# Altium project USB_SPI_Flash.PrjPcb
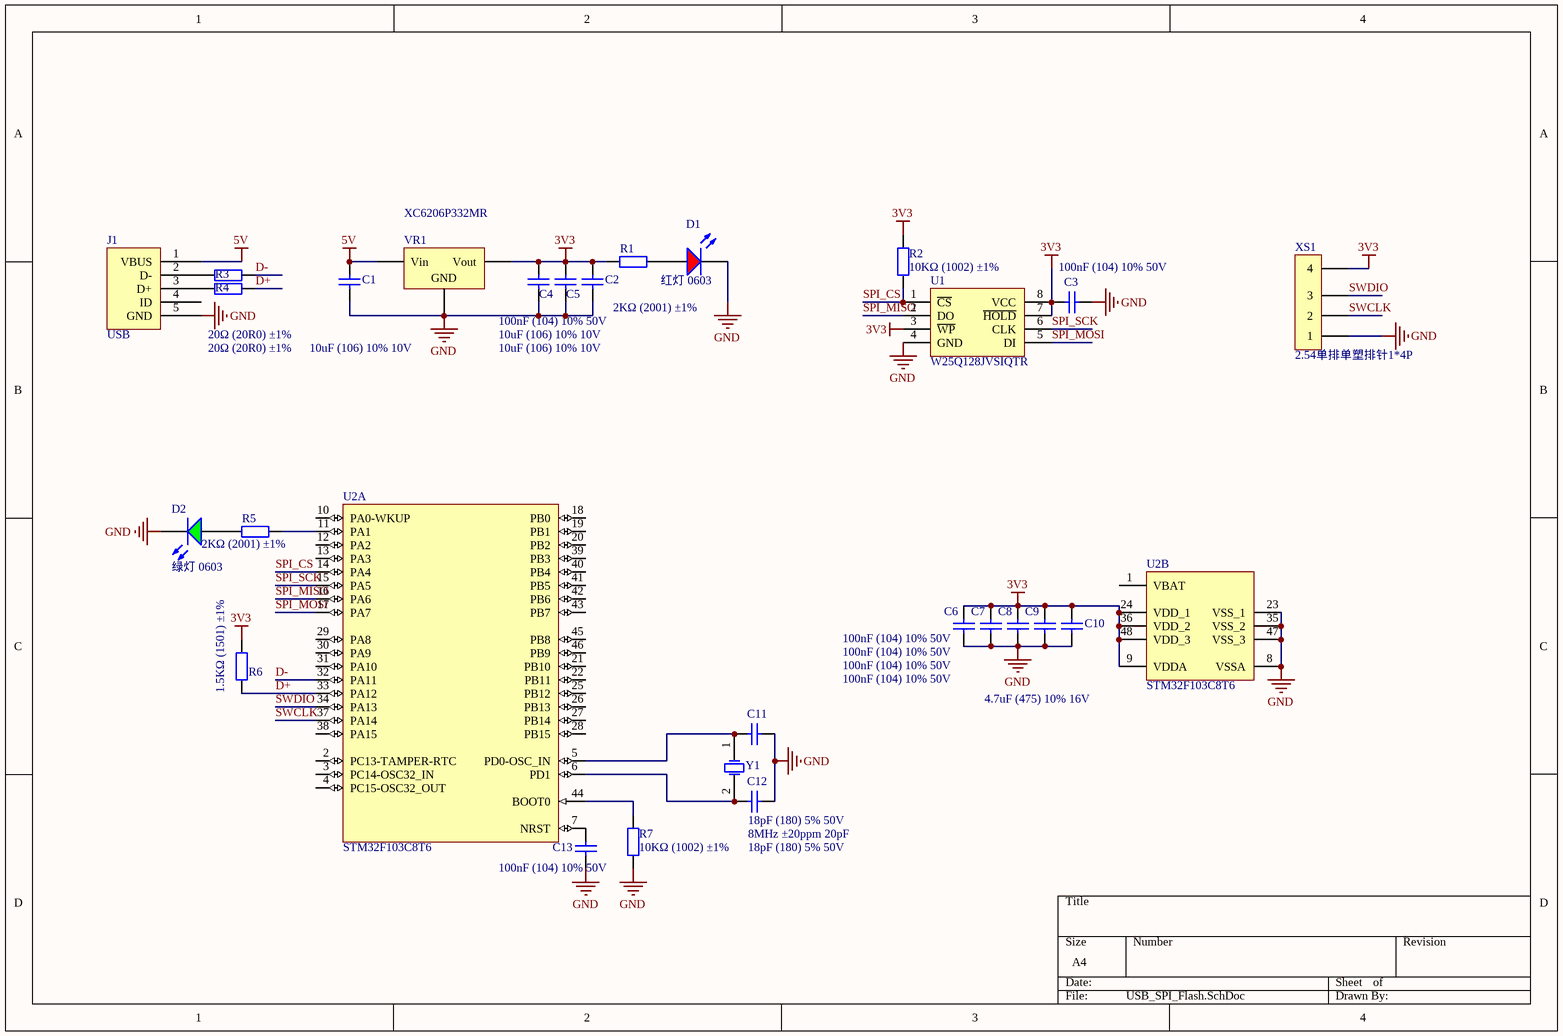
[diagram p0: USB_SPI_Flash.SchDoc]
1 sheet, 28 parts. Net scope: global (net labels, ports and power ports of the same name join across sheets).
Board file: USB_SPI_Flash.PcbDoc

## Sheet USB_SPI_Flash.SchDoc
size A4

### Parts
C1  10uF (106) 10% 10V  [0603_C]
C2  100nF (104) 10% 50V  [0603_C]
C3  100nF (104) 10% 50V  [0603_C]
C4  10uF (106) 10% 10V  [0603_C]
C5  10uF (106) 10% 10V  [0603_C]
C6  100nF (104) 10% 50V  [0603_C]
C7  100nF (104) 10% 50V  [0603_C]
C8  100nF (104) 10% 50V  [0603_C]
C9  100nF (104) 10% 50V  [0603_C]
C10  4.7uF (475) 10% 16V  [0603_C]
C11  18pF (180) 5% 50V  [0603_C]
C12  18pF (180) 5% 50V  [0603_C]
C13  100nF (104) 10% 50V  [0603_C]
D1  红灯 0603  [0603_LED_S1]
D2  绿灯 0603  [0603_LED_S1]
J1  USB  [GOLDFIGER_FPC_8]
R1  2KΩ (2001) ±1%  [0603_R]
R2  10KΩ (1002) ±1%  [0603_R]
R3  20Ω (20R0) ±1%  [0603_R]
R4  20Ω (20R0) ±1%  [0603_R]
R5  2KΩ (2001) ±1%  [0603_R]
R6  1.5KΩ (1501) ±1%  [0603_R]
R7  10KΩ (1002) ±1%  [0603_R]
U1  W25Q128JVSIQTR  [SOIC-8_208mil]
U2  STM32F103C8T6  [LQFP-48_7x7x05P]  (parts A,B of 2)
VR1  XC6206P332MR  [SOT-23-3L]
XS1  2.54单排单塑排针1*4P  [PIN4]
Y1  8MHz ±20ppm 20pF  [SMD-5032_2P]

### Nets
3V3: C2.2 C3.2 C4.2 C5.2 C6.2 C7.2 C8.2 C9.2 C10.2 R1.2 R2.2 R6.2 U1.3(~{WP}) U1.7(~{HOLD}) U1.8(VCC) U2.9(VDDA) U2.24(VDD_1) U2.36(VDD_2) U2.48(VDD_3) VR1.2(Vout) XS1.4
5V: C1.2 J1.1(VBUS) VR1.3(Vin)
GND: C1.1 C2.1 C3.1 C4.1 C5.1 C6.1 C7.1 C8.1 C9.1 C10.1 C11.1 C12.1 C13.1 D1.K D2.K J1.5(GND) R7.1 U1.4(GND) U2.8(VSSA) U2.23(VSS_1) U2.35(VSS_2) U2.47(VSS_3) VR1.1(GND) XS1.1
D+: R4.2 R6.1 U2.33(PA12)
D-: R3.2 U2.32(PA11)
SPI_CS: R2.1 U1.1(~{CS}) U2.14(PA4)
SPI_MISO: U1.2(DO) U2.16(PA6)
SPI_MOSI: U1.5(DI) U2.17(PA7)
SPI_SCK: U1.6(CLK) U2.15(PA5)
SWCLK: U2.37(PA14) XS1.2
SWDIO: U2.34(PA13) XS1.3
NetC11_2: C11.2 U2.5(PD0-OSC_IN) Y1.1(OSC1)
NetC12_2: C12.2 U2.6(PD1) Y1.2(OSC2)
NetC13_2: C13.2 U2.7(NRST)
NetD1_A: D1.A R1.1
NetD2_A: D2.A R5.2
NetJ1_2: J1.2(D-) R3.1
NetJ1_3: J1.3(D+) R4.1
NetR5_1: R5.1 U2.11(PA1)
NetR7_2: R7.2 U2.44(BOOT0)

Not connected (* = marked no-connect by the designer): J1 4(ID); U2 1(VBAT) 2(PC13-TAMPER-RTC) 3(PC14-OSC32_IN) 4(PC15-OSC32_OUT) 10(PA0-WKUP) 12(PA2) 13(PA3) 18(PB0) 19(PB1) 20(PB2) 21(PB10) 22(PB11) 25(PB12) 26(PB13) 27(PB14) 28(PB15) 29(PA8) 30(PA9) 31(PA10) 38(PA15) 39(PB3) 40(PB4) 41(PB5) 42(PB6) 43(PB7) 45(PB8) 46(PB9)

### Library data of the parts
C1 C4 C5 = 0603 10uF (106) 10% 10V: 贴片电容; ComponentLink1Description: 供应商链接; ComponentLink1URL: http://www.szlcsc.com/product/details_20411.html; Package: 0603; Supplier: LC; SuppliersPartNumber: C19702
C2 C3 C6-C9 C13 = 0603 100nF (104) 10% 50V: 贴片电容; ComponentLink1Description: 供应商链接; ComponentLink1URL: http://www.szlcsc.com/product/details_15331.html; Package: 0603; Supplier: LC; SuppliersPartNumber: C14663
C10 = 0603 4.7uF (475) 10% 16V: 贴片电容; ComponentLink1Description: 供应商链接; ComponentLink1URL: http://www.szlcsc.com/product/details_20375.html; Package: 0603; Supplier: LC; SuppliersPartNumber: C19666
C11 C12 = 0603 18pF (180) 5% 50V: 贴片电容; ComponentLink1Description: 供应商链接; ComponentLink1URL: http://www.szlcsc.com/product/details_1999.html; Package: 0603; Supplier: LC; SuppliersPartNumber: C1647
D1 = 0603 红灯: 发光二极管; ComponentLink1Description: 供应商链接; ComponentLink1URL: http://www.szlcsc.com/product/details_2659.html; Package: 0603; Supplier: LC; SuppliersPartNumber: C2286
D2 = 0603 绿灯: 发光二极管; ComponentLink1Description: 供应商链接; ComponentLink1URL: http://www.szlcsc.com/product/details_73152.html; Package: 0603; Supplier: LC; SuppliersPartNumber: C72043
R1 R5 = 0603 2KΩ (2001) 1%: 贴片电阻; ComponentLink1Description: 供应商链接; ComponentLink1URL: http://www.szlcsc.com/product/details_23702.html; Package: 0603; Supplier: LC; SuppliersPartNumber: C22975
R2 R7 = 0603 10KΩ (1002) 1%: 贴片电阻; ComponentLink1Description: 供应商链接; ComponentLink1URL: http://www.szlcsc.com/product/details_26547.html; Package: 0603; Supplier: LC; SuppliersPartNumber: C25804
R3 R4 = 0603 20Ω (20R0) 1%: 贴片电阻; ComponentLink1Description: 供应商链接; ComponentLink1URL: http://www.szlcsc.com/product/details_23677.html; Package: 0603; Supplier: LC; SuppliersPartNumber: C22950
R6 = 0603 1.5KΩ (1501) 1%: 贴片电阻; ComponentLink1Description: 供应商链接; ComponentLink1URL: http://www.szlcsc.com/product/details_23570.html; Package: 0603; Supplier: LC; SuppliersPartNumber: C22843
U1 = W25Q128JVSIQTR_[C97521]: Flash ROM; ComponentLink1Description: 供应商链接; ComponentLink1URL: https://item.szlcsc.com/98729.html; Package: SOIC-8; Supplier: LC; SuppliersPartNumber: C97521
U2 = STM32F103C8T6: ARM; ComponentLink1Description: 供应商链接; ComponentLink1URL: http://www.szlcsc.com/product/details_9243.html; Package: LQFP-48_7x7x05P; Supplier: LC; SuppliersPartNumber: C8734
VR1 = SOT-23 XC6206P332MR: 低压差线性稳压(LDO); ComponentLink1Description: 供应商链接; ComponentLink1URL: http://www.szlcsc.com/product/details_5896.html; Package: SOT-23; Supplier: LC; SuppliersPartNumber: C5446
Y1 = SMD-5032_2P 8MHz 20ppm 20pF: 贴片晶振; ComponentLink1Description: 供应商链接; ComponentLink1URL: http://www.szlcsc.com/product/details_117214.html; Package: SMD-5032_2P; Supplier: LC; SuppliersPartNumber: C115962